# EAGLE design emg-ps-usb_rev1 (EAGLE 6.5.0)
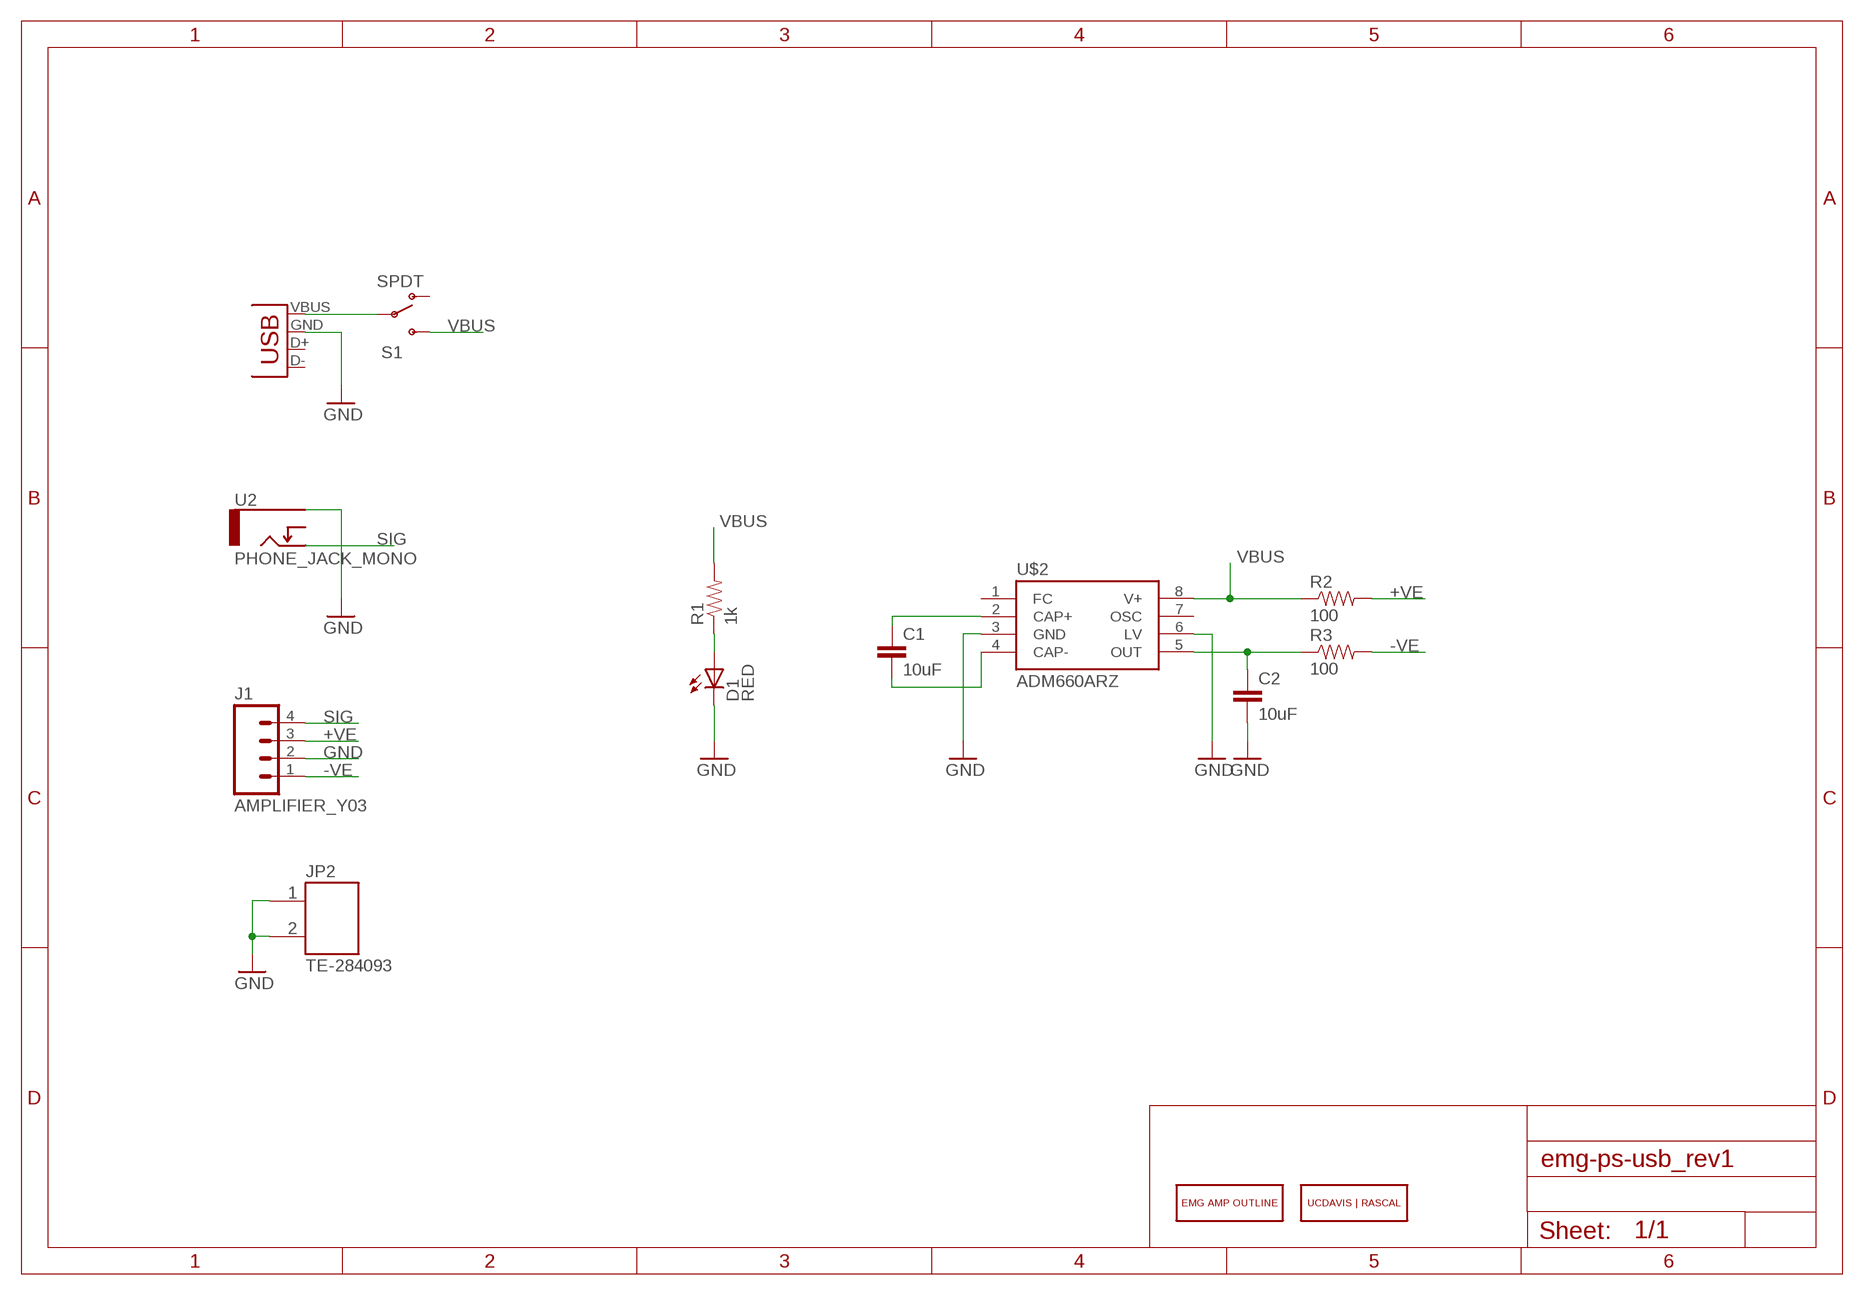
[diagram p0: schematic, sheet 1]

## Parts
C1  10uF  CAP0805  [0805]
C2  10uF  CAP0805  [0805]
D1  RED  LED-RED0603  [LED-0603]
J1  AMPLIFIER_Y03  [AMPLIFIER_WTB]
JP1  USB-A-H  [USB-A-H]
JP2  TE-284093  [TE-284093]
R1  1k  RESISTOR0805-RES  [0805]
R2  100  RESISTOR0805-RES  [0805]
R3  100  RESISTOR0805-RES  [0805]
S1  SPDT  SWITCH-SPDT-SMD-A  [SWITCH-SPST-SMD-A]
U2  PHONE_JACK_MONO  [MJ-3523-SMT]
U$1  UCDAVIS-RASCAL_LOGO-2LINE  [UCDAVIS-RASCAL_LOGO]
U$2  ADM660ARZ  [SOIC8]
U$3  EMG_AMP_OUTLINE-Y03ENDS  [EMG_Y03_OUTLINEENDS]

## Nets
+VE: J1.3 R2.2
-VE: J1.1 R3.2
GND: C2.2 D1.C J1.2 JP1.GND(VBUS) JP2.P$1 JP2.P$2 U2.P$1 U$2.3(GND) U$2.6(LV)
N$1: JP1.VBUS(GND) S1.2(P)
N$3: D1.A R1.1
N$4: C2.1 R3.1 U$2.5(OUT)
N$5: C1.2 U$2.4(CAP-)
N$6: C1.1 U$2.2(CAP+)
SIG: J1.4 U2.P$2
VBUS: R1.2 R2.1 S1.3(S) U$2.8(V+)
Unconnected: JP1.D+(D-) JP1.D-(D+) S1.1(O) U2.P$3 U$2.1(FC) U$2.7(OSC)

## Library data of the parts
C1 C2 = SparkFun-Capacitors:CAP: Capacitor Standard 0603 ceramic capacitor, and 0.1" leaded capacitor.
D1 = SparkFun-LED:LED-RED: Assorted Red LEDs LilyPad 1206- DIO-09912 1206- DIO-00809 0603- DIO-00819; PROD_ID: DIO-00819
J1 = eagle-lib:AMPLIFIER_Y03: Wire-to-board interface for the Motion Labs Y03 amplifiers.
JP1 = SparkFun-Connectors:USB: USB Connectors USB-B-PTH is fully proven SKU : PRT-00139/CONN-08278 USB-miniB is fully proven SKU : PRT-00587 USB-A-PCB is untested. USB-A-H is throughly reviewed, but untested. Spark Fun Electronics SKU : PRT-00437 USB-B-SMT is throughly reviewed, but untested. Needs silkscreen touching up. USB-A-S has not been used/tested USB-MB-H has not been used/tested USB-MICROB has been used. CONN-09505
JP2 = eagle-lib:TE-284093
R1-R3 = SparkFun-Resistors:RESISTOR: Resistor Basic schematic elements and footprints for 0603, 1206, and PTH resistors.
S1 = SparkFun-Electromechanical:SWITCH-SPDT: SPDT Switch Simple slide switch, Spark Fun Electronics SKU : COM-00102 DPDT SMT slide switch, AYZ0202, SWCH-08179
U2 = eagle-lib:PHONE_JACK_MONO
U$1 = ucdrascal-eagle-lib:UCDAVIS-RASCAL_LOGO
U$2 = eagle-lib:ADM660: Analog Devices charge-pump voltage converter that can be used to either invert the input supply voltage or double it. Input voltages ranging from +1.5V to +7V can be inverted into a negative -1.5V to -7V output supply. Datasheet: http://www.analog.com/static/imported-files/data_sheets/ADM660_8660.pdf
U$3 = ucdrascal-eagle-lib:EMG_AMP_OUTLINE

## Board
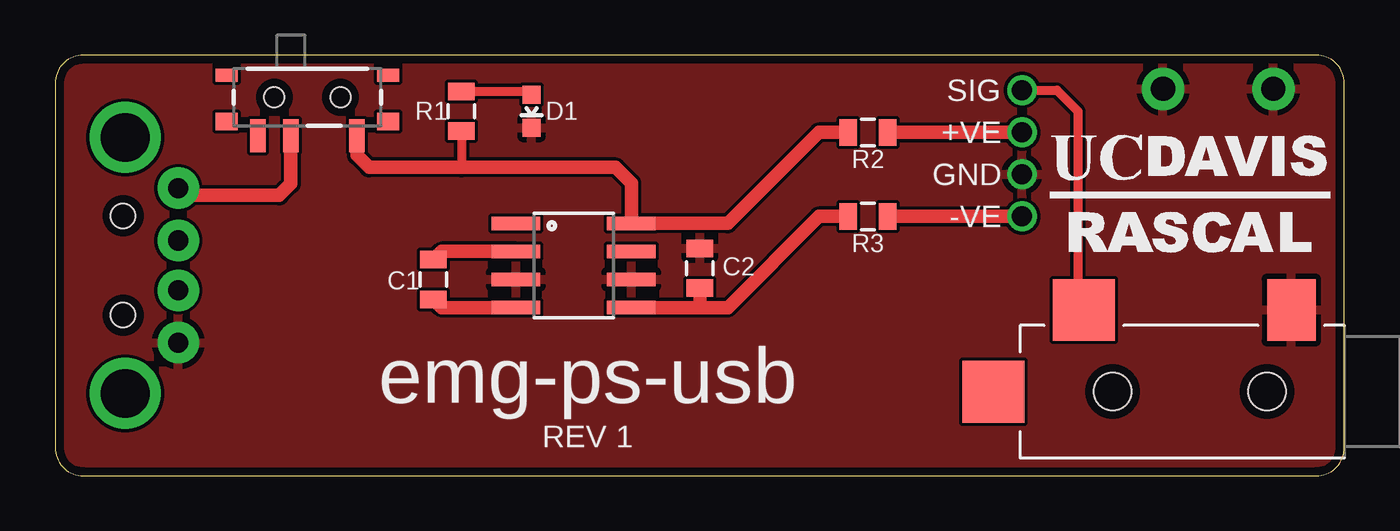
[diagram p1: board, top side]
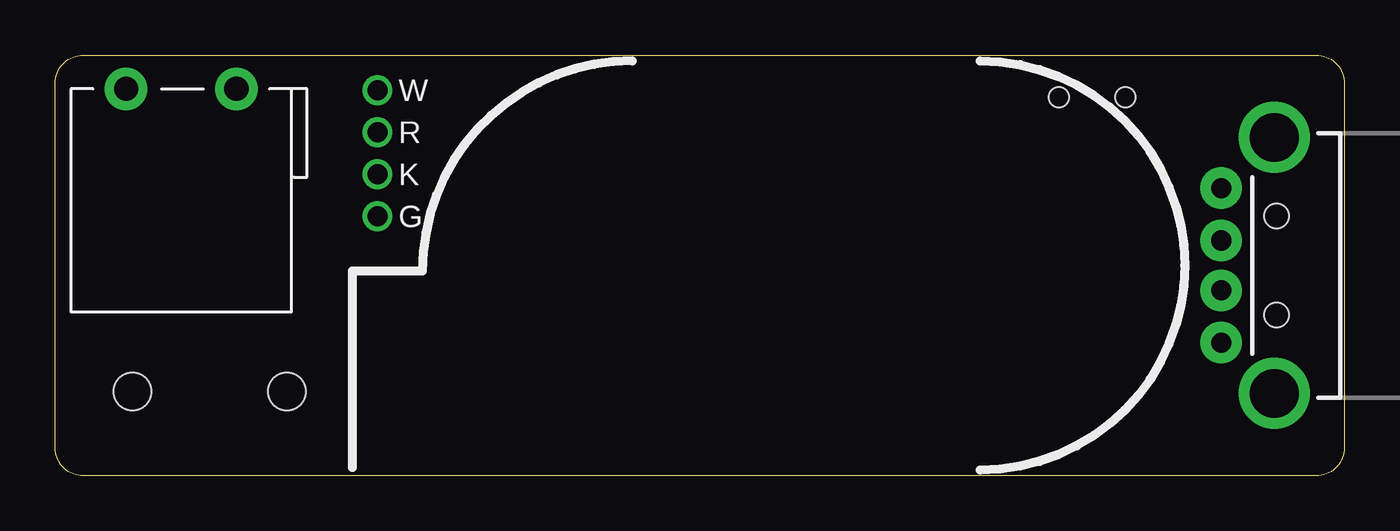
[diagram p2: board, bottom side, seen from below]

Size 58.42 x 19.05 mm. Coordinates in mm from the lower left corner, seen from the top.
Outline: 57.15,19.05 1.27,19.05 arc90 0,17.78 0,1.27 arc90 1.27,0 57.15,0 arc90 58.42,1.27 58.42,17.78 arc90 57.15,19.05
Copper layers (1*16): Top 0.0356mm / dielectric 1.5011mm / Bottom 0.0356mm
Design rules "LaenPCBOrder": minimum track width 6mil, minimum drill 13mil, track to track 6mil, track to pad 6mil, pad to pad 6mil, via to via 6mil, smd to smd 6mil, copper to edge 15mil, drill to drill 6mil, minimum pad ring 7mil, minimum via ring 7mil, stop-mask expansion 4mil, vias tented up to drill 0mil, thermal gap 10mil

### Footprints (pad centres in the part's own frame; a part is rotated, then mirrored left to right if it is on the bottom)
0805 = smd 0.8 x 1.2: 1 -0.9,0; 2 0.9,0
LED-0603 = smd 0.8 x 0.8: A 0,-0.75; C 0,0.75
AMPLIFIER_WTB = drill 0.9: 1 -2.857,0; 2 -0.953,0; 3 0.953,0; 4 2.857,0
USB-A-H = drill 0.914 pad 1.88: D+ 2.4,1.127; D- 2.4,-1.127; GND 2.4,3.5; VBUS 2.4,-3.5 | drill 2.2: GND2 0,-5.8; GND3 0,5.8 | hole 1.1: -0.1,2.25; -0.1,-2.25
TE-284093 = drill 1.1 pad 1.93: P$1 -2.5,0; P$2 2.5,0
SWITCH-SPST-SMD-A = smd 0.7 x 1.5: 1 -2.25,-1.75; 2 -0.75,-1.75; 3 2.25,-1.75 | smd 1 x 0.6: GND1 -3.65,1; GND3 3.65,1 | smd 1 x 0.8: GND2 -3.65,-1.1; GND4 3.65,-1.1 | hole 0.9: -1.5,0; 1.5,0
MJ-3523-SMT = smd 2.2 x 2.8: P$1 -2.4,3.7 | smd 2.8 x 2.8: P$2 -11.8,3.7; P$3 -15.9,0 | hole 1.7: -10.5,0; -3.5,0
SOIC8 = smd 0.61 x 2.21: 1 -1.905,-2.616; 2 -0.635,-2.616; 3 0.635,-2.616; 4 1.905,-2.616; 5 1.905,2.616; 6 0.635,2.616; 7 -0.635,2.616; 8 -1.905,2.616

### Placement (x,y rotation side)
C1  17.14,8.89 270 top
C2  29.21,9.4 90 top
D1  21.59,16.51 180 top
J1  43.81,14.61 90 top
JP1  3.17,9.53 180 bottom
JP2  52.7,17.53 180 bottom
R1  18.41,16.51 270 top
R2  36.83,15.56 0 top
R3  36.83,11.75 0 top
S1  11.43,17.14 0 top
U2  58.42,3.81 0 top
U$1  51.44,12.7 0 top
U$2  23.5,9.53 270 top
U$3  44.96,-0.25 0 bottom

### Tracks (layer width: path | path; a pad name or v marks a point on that pad's centre or on a via)
+VE
  Top 0.61: R2.2 J1.3
-VE
  Top 0.61: R3.2 J1.1
GND
  pour Top: 58.42,19.05 0,19.05 0,0 58.42,0
N$1
  Top 0.61: S1.2 10.68,13.22 10.16,12.7 5.9,12.7 JP1.VBUS
N$3
  Top 0.406: R1.1 21.44,17.41 D1.A
N$4
  Top 0.61: 29.21,7.62 30.48,7.62 34.61,11.75 R3.1 | 29.21,7.62 U$2.5 | C2.1 29.21,7.62
N$5
  Top 0.61: U$2.4 17.52,7.62 C1.2
N$6
  Top 0.61: U$2.2 17.52,10.16 C1.1
SIG
  Top 0.406: U2.P$2 46.35,7.78 46.35,16.51 45.4,17.46 J1.4
VBUS
  Top 0.406: R1.2 18.41,13.97
  Top 0.61: S1.3 13.68,14.51 14.22,13.97 18.41,13.97 25.4,13.97 26.11,13.26 U$2.8 30.48,11.43 34.61,15.56 R2.1

### Text on the board
tPlace: SIG | +VE | GND | -VE | emg-ps-usb | REV 1
bPlace: W | R | K | G
tNames: D1